# Altium schematic sheet USE C.SchDoc
size A; SheetNumber: 2; SheetTotal: 3
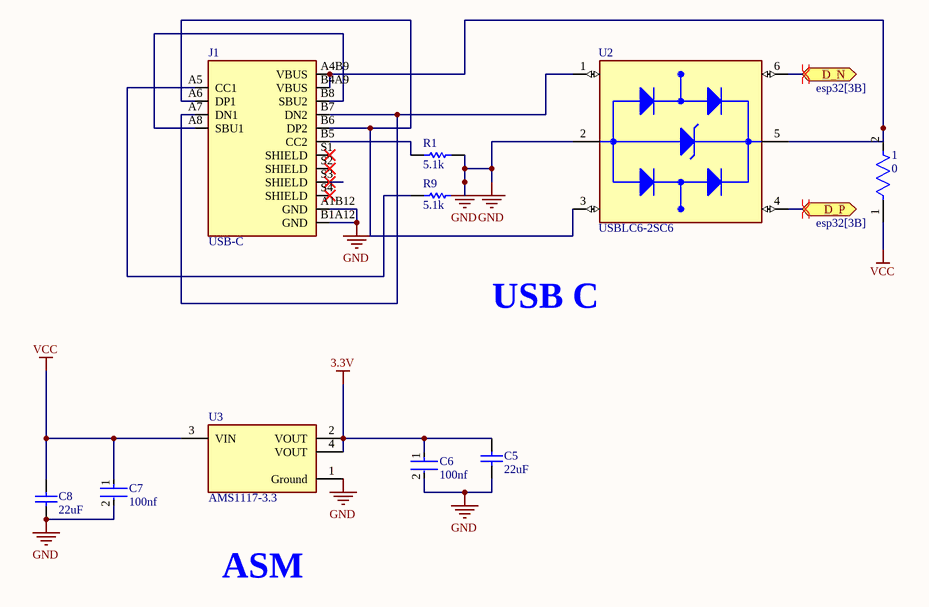
[diagram p0: USE C.SchDoc]

## Parts
1  0  [FP-RC0402-0_4-IPC_A]
C5  22uF  [CAPC3216X180X55ML20T25]
C6  100nf  [FP-CC0603-DA-MFG]
C7  100nf  [FP-CC0603-DA-MFG]
C8  22uF  [CAPC3216X180X55ML20T25]
J1  USB-C  [HRO_TYPE-C-31-M-12]
R1  5.1k  [RESC1005X40X25NL05T10]
R9  5.1k  [RESC1005X40X25NL05T10]
U2  USBLC6-2SC6  [SOT95P280X145-6N]
U3  AMS1117-3.3  [FP-AMS1117-IPC_C]

## Ports
D_N (bidir, see esp32[3B]), D_P (bidir, see esp32[3B])

## Nets
3.3V: C5.2 C6.1 U3.2(VOUT) U3.4(VOUT)
GND: C5.1 C6.2 C7.2 C8.1 J1.A1B12(GND) J1.B1A12(GND) R1.2 R9.2 U2.2(GND) U3.1(Ground)
VCC: 1.1 C7.1 C8.2 U3.3(VIN)
D_N: U2.6(I/O1_OUT) ; port D_N
D_P: U2.4(I/O2_OUT) ; port D_P
Net1_2: 1.2 J1.A4B9(VBUS) J1.B4A9(VBUS) U2.5(VBUS)
NetJ1_A5: J1.A5(CC1) R9.1
NetJ1_A6: J1.A6(DP1) J1.B6(DP2) U2.3(I/O2_IN)
NetJ1_A7: J1.A7(DN1) J1.B7(DN2) U2.1(I/O1_IN)
NetJ1_A8: J1.A8(SBU1) J1.B8(SBU2)
NetJ1_B5: J1.B5(CC2) R1.1

Not connected (* = marked no-connect by the designer): J1 S1(SHIELD)* S2(SHIELD)* S3(SHIELD)* S4(SHIELD)*

## Layout directives
differential pair: D_N, D_P

## Notes on the sheet
- USB C
- ASM

## Library data of the parts
1 = CMP-2002-07342-2: RES SMD 0 OHM JUMPER 1/16W 0402; Resistance: 0R; Temperature Coefficient: 200ppm/°C; Tolerance: 1%; Power Rating: 62.5mW; Voltage Rating: 50V; Max Power Dissipation: 63mW; Features: Moisture Resistant; Length: 1mm; Case Code (Metric): 1005; Series: RC; RoHS Compliant: Yes; Resistor Type: Thick Film; Height: 0.35mm; Min Operating Temperature: -55°C; Case Code (Imperial): 0402; Number of Terminations: 2; Contact Plating: Tin; Case/Package: 0402; Size Code: 0402; Termination: SMD/SMT; Max Operating Temperature: 155°C; Width: 0.5mm; Mount: Surface Mount; Lead Free: Lead Free; Packaging: Tape and Reel; Radiation Hardening: No
C5 C8 = CMP-1662-00010-2: Chip Capacitor, 22 uF, +/- 10%, 25 V, -55 to 85 degC, 1206 (3216 Metric), RoHS, Tape and Reel; PartNumber: GRM31CR61E226KE15L; Voltage Rating: 25 V; Type (Capacitors): X5R; Case\/Package: 1206; PackageDescription: 2-Pin Surface Mount Device, Body 3.2 x 1.6 mm; ComponentLink1URL: http://www.murata.com/; Mount: Surface Mount; Capacitance: 22 uF; PackageReference: 1206; ComponentLink2Description: Datasheet; ComponentLink1Description: Manufacturer URL; Min Operating Temperature: -55 degC; RoHSCompliant: true; Radiation Hardening: No; Package Quantity: 2000; Length: 3.2 mm; Height: 1.6 mm; ComponentLink2URL: http://search.murata.co.jp/Ceramy/image/img/A01X/G101/ENG/GRM31CR61E226KE15-01.pdf; Width: 1.6 mm; Case Code (Imperial): 1206; Max Operating Temperature: 85 degC; Mounting Technology: Surface Mount; Tolerance: 10%; Voltage Rating (DC): 25 V; Pins: 2; Packaging: Tape and Reel; DatasheetVersion: 03/2016; Case Code (Metric): 3216; REACH SVHC: No SVHC
C6 C7 = CMP-2100-03601-2: CAP CER 0.1UF 50V X7R 0603; Manufacturer: YAGEO; Manufacturer Part Number: CC0603KRX7R9BB104; Material: Ceramic; Temperature Coefficient: 15%; Tolerance: 0.1; Height: 0.9mm; Voltage: 50 V; ComponentLink2Description: Datasheet; Device Class L2: Capacitors; Temperature Range High: +125°C; Category: Cap; Capacitance: 100 nF; Footprint Url: http://www.yageo.com/exep/pages/download/literatures/UPY-C_GEN_24.pdf; ComponentLink2URL: http://www.yageo.com/documents/recent/UPY-GPHC_X7R_6.3V-to-50V_18.pdf; Package: CC0603-DA; Temperature: -55°C to +125°C; Voltage Rating: 50 V; Temperature Characteristic: X7R; Device Class L1: Passive Components; Temperature Range Low: -55°C; RoHS: TRUE; Automotive: No; Value: 100 nF; Device Class L3: Ceramic Capacitors; Octopart: https://octopart.com/cc0603krx7r9bb104-yageo-42244635; Mouser Description: Multilayer Ceramic Capacitor, CC Series, 0.1 - F, - 10%, X7R, 50 V, 0603 [1608 Metric]; Lead Free: Yes; Digikey Description: CAP CER 0.1UF 50V X7R 0603
J1 = USB-C: USB-C (USB TYPE-C) USB 3.2 Gen 2 (USB 3.1 Gen 2, Superspeed + (USB 3.1)) Receptacle Connector 24 Position Surface Mount, Through Hole; MF: Adam Technologies; SnapEDA_Link: https://www.snapeda.com/parts/USB-C/Adam+Tech/view-part/?ref=snap; Package: None; Value: *; MP: USB-C; Check_prices: https://www.snapeda.com/parts/USB-C/Adam+Tech/view-part/?ref=eda
R1 R9 = CMP-2002-07753-1: Part Number: RC0402FR-075K1L; Manufacturer: Yageo / Phycomp
U2 = USBLC6-2SC6: 17V Clamp 5A (8/20Âµs) Ipp Tvs Diode Surface Mount SOT-23-6; MF: STMicroelectronics; Value: *; SnapEDA_Link: https://www.snapeda.com/parts/USBLC6-2SC6/STMicroelectronics/view-part/?ref=snap; Check_prices: https://www.snapeda.com/parts/USBLC6-2SC6/STMicroelectronics/view-part/?ref=eda; Purchase-URL: https://pricing.snapeda.com/search/part/USBLC6-2SC6/?ref=eda; Price: None; Availability: In Stock; Package: SOT-23-6 STMicroelectronics; MP: USBLC6-2SC6
U3 = CMP-209535-000001-1: LDO Voltage Regulators 1A, 3.3V; Manufacturer: Advanced Monolithic Systems; Dropout Voltage: 1.1V; Output Type: Fixed; Nominal Supply Current: 5mA; Max Power Dissipation: 1.2W; Max Supply Voltage: 15V; Number Of Outputs: 1; Standoff Height: 0.64mm; Max Junction Temp: +125°C; Height: 1.8mm; Package: AMS1117; Device Class L2: Power Management ICs; ComponentLink2Description: Datasheet; ComponentLink2URL: http://www.advanced-monolithic.com/pdf/ds1117.pdf; Category: IC; RoHS: TRUE; Automotive: No; Device Class L1: Integrated Circuits (ICs); Output Current: 1A; Device Class L3: Voltage Regulators - Linear; Temperature: -40°C to +125°C; Output Voltage: 3.3V; Manufacturer Part Number: AMS1117-3.3; Temperature Range Low: -40°C; Octopart: https://octopart.com/ams1117-3.3-advanced+monolithic+systems-25899300; Lead Free: Yes; Ipc Land Pattern Name: SOT229P700X180-4; Temperature Range High: +125°C